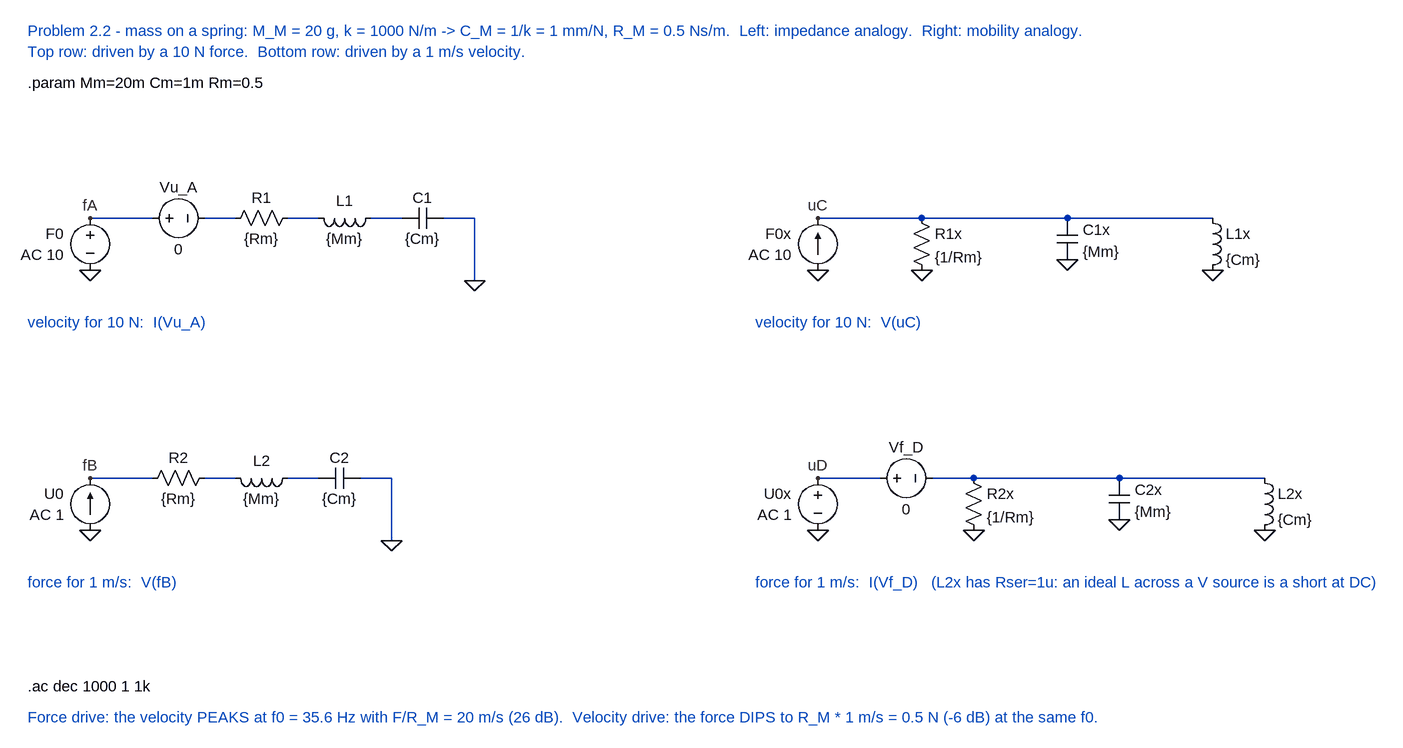
[diagram p0: schematic P2_2_Mass_Spring.asc]
P2_2_Mass_Spring.asc, the LTspice schematic file:
Version 4
SHEET 1 3000 1600
WIRE 0 0 96 0
WIRE 176 0 224 0
WIRE 304 0 352 0
WIRE 432 0 480 0
WIRE 544 0 592 0
WIRE 592 0 592 96
WIRE 0 400 96 400
WIRE 176 400 224 400
WIRE 304 400 352 400
WIRE 416 400 464 400
WIRE 464 400 464 496
WIRE 1120 0 1728 0
WIRE 1120 400 1216 400
WIRE 1296 400 1360 400
WIRE 1360 400 1808 400
FLAG 0 80 0
FLAG 0 0 fA
FLAG 592 96 0
FLAG 0 480 0
FLAG 0 400 fB
FLAG 464 496 0
FLAG 1120 80 0
FLAG 1120 0 uC
FLAG 1280 80 0
FLAG 1504 64 0
FLAG 1728 80 0
FLAG 1120 480 0
FLAG 1120 400 uD
FLAG 1360 480 0
FLAG 1584 464 0
FLAG 1808 480 0
SYMBOL voltage 0 -16 R0
WINDOW 0 -40 40 Right 2
WINDOW 3 -40 72 Right 2
SYMATTR InstName F0
SYMATTR Value AC 10
SYMBOL voltage 80 0 R270
WINDOW 0 32 56 VTop 2
WINDOW 3 -32 56 VBottom 2
SYMATTR InstName Vu_A
SYMATTR Value 0
SYMBOL res 320 -16 R90
WINDOW 0 0 56 VBottom 2
WINDOW 3 32 56 VTop 2
SYMATTR InstName R1
SYMATTR Value {Rm}
SYMBOL ind 448 -16 R90
WINDOW 0 5 56 VBottom 2
WINDOW 3 32 56 VTop 2
SYMATTR InstName L1
SYMATTR Value {Mm}
SYMATTR SpiceLine Rser=0
SYMBOL cap 544 -16 R90
WINDOW 0 0 32 VBottom 2
WINDOW 3 32 32 VTop 2
SYMATTR InstName C1
SYMATTR Value {Cm}
SYMBOL current 0 480 R180
WINDOW 0 40 56 Left 2
WINDOW 3 40 24 Left 2
SYMATTR InstName U0
SYMATTR Value AC 1
SYMBOL res 192 384 R90
WINDOW 0 0 56 VBottom 2
WINDOW 3 32 56 VTop 2
SYMATTR InstName R2
SYMATTR Value {Rm}
SYMBOL ind 320 384 R90
WINDOW 0 5 56 VBottom 2
WINDOW 3 32 56 VTop 2
SYMATTR InstName L2
SYMATTR Value {Mm}
SYMATTR SpiceLine Rser=0
SYMBOL cap 416 384 R90
WINDOW 0 0 32 VBottom 2
WINDOW 3 32 32 VTop 2
SYMATTR InstName C2
SYMATTR Value {Cm}
SYMBOL current 1120 80 R180
WINDOW 0 40 56 Left 2
WINDOW 3 40 24 Left 2
SYMATTR InstName F0x
SYMATTR Value AC 10
SYMBOL res 1264 -16 R0
SYMATTR InstName R1x
SYMATTR Value {1/Rm}
SYMBOL cap 1488 0 R0
WINDOW 0 40 18 Left 2
WINDOW 3 40 52 Left 2
SYMATTR InstName C1x
SYMATTR Value {Mm}
SYMBOL ind 1712 -16 R0
SYMATTR InstName L1x
SYMATTR Value {Cm}
SYMATTR SpiceLine Rser=0
SYMBOL voltage 1120 384 R0
WINDOW 0 -40 40 Right 2
WINDOW 3 -40 72 Right 2
SYMATTR InstName U0x
SYMATTR Value AC 1
SYMBOL voltage 1200 400 R270
WINDOW 0 32 56 VTop 2
WINDOW 3 -32 56 VBottom 2
SYMATTR InstName Vf_D
SYMATTR Value 0
SYMBOL res 1344 384 R0
SYMATTR InstName R2x
SYMATTR Value {1/Rm}
SYMBOL cap 1568 400 R0
WINDOW 0 40 18 Left 2
WINDOW 3 40 52 Left 2
SYMATTR InstName C2x
SYMATTR Value {Mm}
SYMBOL ind 1792 384 R0
SYMATTR InstName L2x
SYMATTR Value {Cm}
SYMATTR SpiceLine Rser=1u
TEXT -96 -288 Left 2 ;Problem 2.2 - mass on a spring: M_M = 20 g, k = 1000 N/m -> C_M = 1/k = 1 mm/N, R_M = 0.5 Ns/m.  Left: impedance analogy.  Right: mobility analogy.
TEXT -96 -256 Left 2 ;Top row: driven by a 10 N force.  Bottom row: driven by a 1 m/s velocity.
TEXT -96 -208 Left 2 !.param Mm=20m Cm=1m Rm=0.5
TEXT -96 160 Left 2 ;velocity for 10 N:  I(Vu_A)
TEXT -96 560 Left 2 ;force for 1 m/s:  V(fB)
TEXT 1024 160 Left 2 ;velocity for 10 N:  V(uC)
TEXT 1024 560 Left 2 ;force for 1 m/s:  I(Vf_D)   (L2x has Rser=1u: an ideal L across a V source is a short at DC)
TEXT -96 720 Left 2 !.ac dec 1000 1 1k
TEXT -96 768 Left 2 ;Force drive: the velocity PEAKS at f0 = 35.6 Hz with F/R_M = 20 m/s (26 dB).  Velocity drive: the force DIPS to R_M * 1 m/s = 0.5 N (-6 dB) at the same f0.

The netlist it stands for:
* P2_2_Mass_Spring.asc
V§F0 fA 0 AC 10
Vu_A fA N001 0
R1 N002 N001 {Rm}
L1 N003 N002 {Mm} Rser=0
C1 0 N003 {Cm}
I§U0 0 fB AC 1
R2 N004 fB {Rm}
L2 N005 N004 {Mm} Rser=0
C2 0 N005 {Cm}
I§F0x 0 uC AC 10
R1x uC 0 {1/Rm}
C1x uC 0 {Mm}
L1x uC 0 {Cm} Rser=0
V§U0x uD 0 AC 1
Vf_D uD N006 0
R2x N006 0 {1/Rm}
C2x N006 0 {Mm}
L2x N006 0 {Cm} Rser=1u
* Problem 2.2 - mass on a spring: M_M = 20 g, k = 1000 N/m -> C_M = 1/k = 1 mm/N, R_M = 0.5 Ns/m.  Left: impedance analogy.  Right: mobility analogy.
* Top row: driven by a 10 N force.  Bottom row: driven by a 1 m/s velocity.
.param Mm=20m Cm=1m Rm=0.5
* velocity for 10 N:  I(Vu_A)
* force for 1 m/s:  V(fB)
* velocity for 10 N:  V(uC)
* force for 1 m/s:  I(Vf_D)   (L2x has Rser=1u: an ideal L across a V source is a short at DC)
.ac dec 1000 1 1k
* Force drive: the velocity PEAKS at f0 = 35.6 Hz with F/R_M = 20 m/s (26 dB).  Velocity drive: the force DIPS to R_M * 1 m/s = 0.5 N (-6 dB) at the same f0.
.backanno
.end